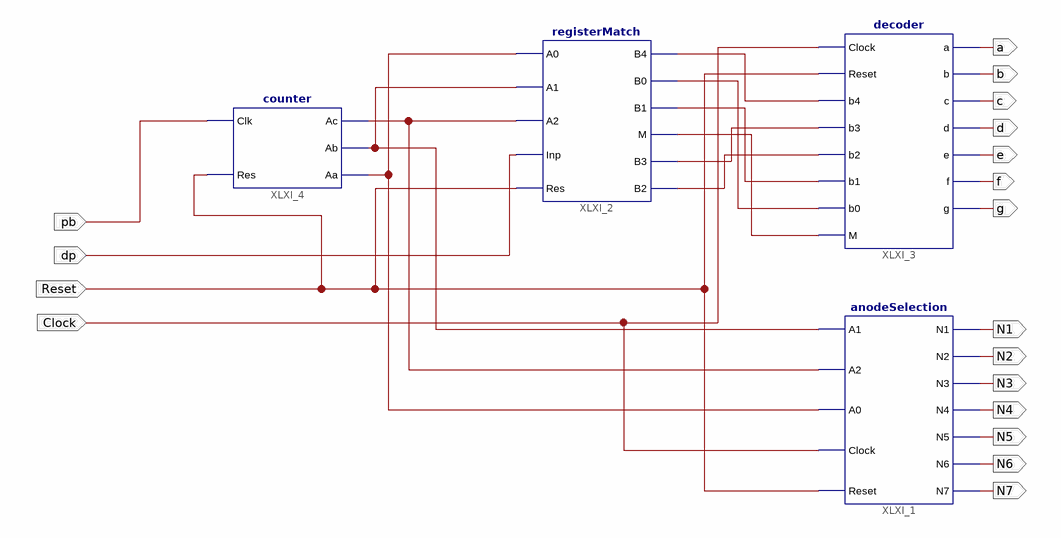
[diagram p0: schematic sheet 1]
// Xilinx ISE schematic aTOP.sch (xc9500xl) as structural Verilog: 4 symbols, 18 ports
module aTOP (
  input  Reset,
  input  Clock,
  input  dp,
  input  pb,
  output a,
  output b,
  output c,
  output d,
  output e,
  output f,
  output g,
  output N1,
  output N2,
  output N3,
  output N4,
  output N5,
  output N6,
  output N7
);

  wire XLXN_1, XLXN_2, XLXN_3, XLXN_4, XLXN_5, XLXN_6, XLXN_14, XLXN_16, XLXN_18;

  registerMatch XLXI_2 (
    .A0(XLXN_14), .A1(XLXN_16), .A2(XLXN_18), .Inp(dp), .Res(Reset), .B4(XLXN_1), .B0(XLXN_2), .B1(XLXN_3),
    .M(XLXN_6), .B3(XLXN_4), .B2(XLXN_5));
  decoder XLXI_3 (
    .Clock(Clock), .Reset(Reset), .b4(XLXN_1), .b3(XLXN_4), .b2(XLXN_5), .b1(XLXN_3), .b0(XLXN_2),
    .M(XLXN_6), .a(a), .b(b), .c(c), .d(d), .e(e), .f(f), .g(g));
  counter XLXI_4 (.Clk(pb), .Res(Reset), .Ac(XLXN_18), .Ab(XLXN_16), .Aa(XLXN_14));
  anodeSelection XLXI_1 (
    .A1(XLXN_16), .A2(XLXN_18), .A0(XLXN_14), .Clock(Clock), .Reset(Reset), .N1(N1), .N2(N2), .N3(N3),
    .N4(N4), .N5(N5), .N6(N6), .N7(N7));
endmodule
